# EAGLE schematic main_low_pass (EAGLE 6.4)
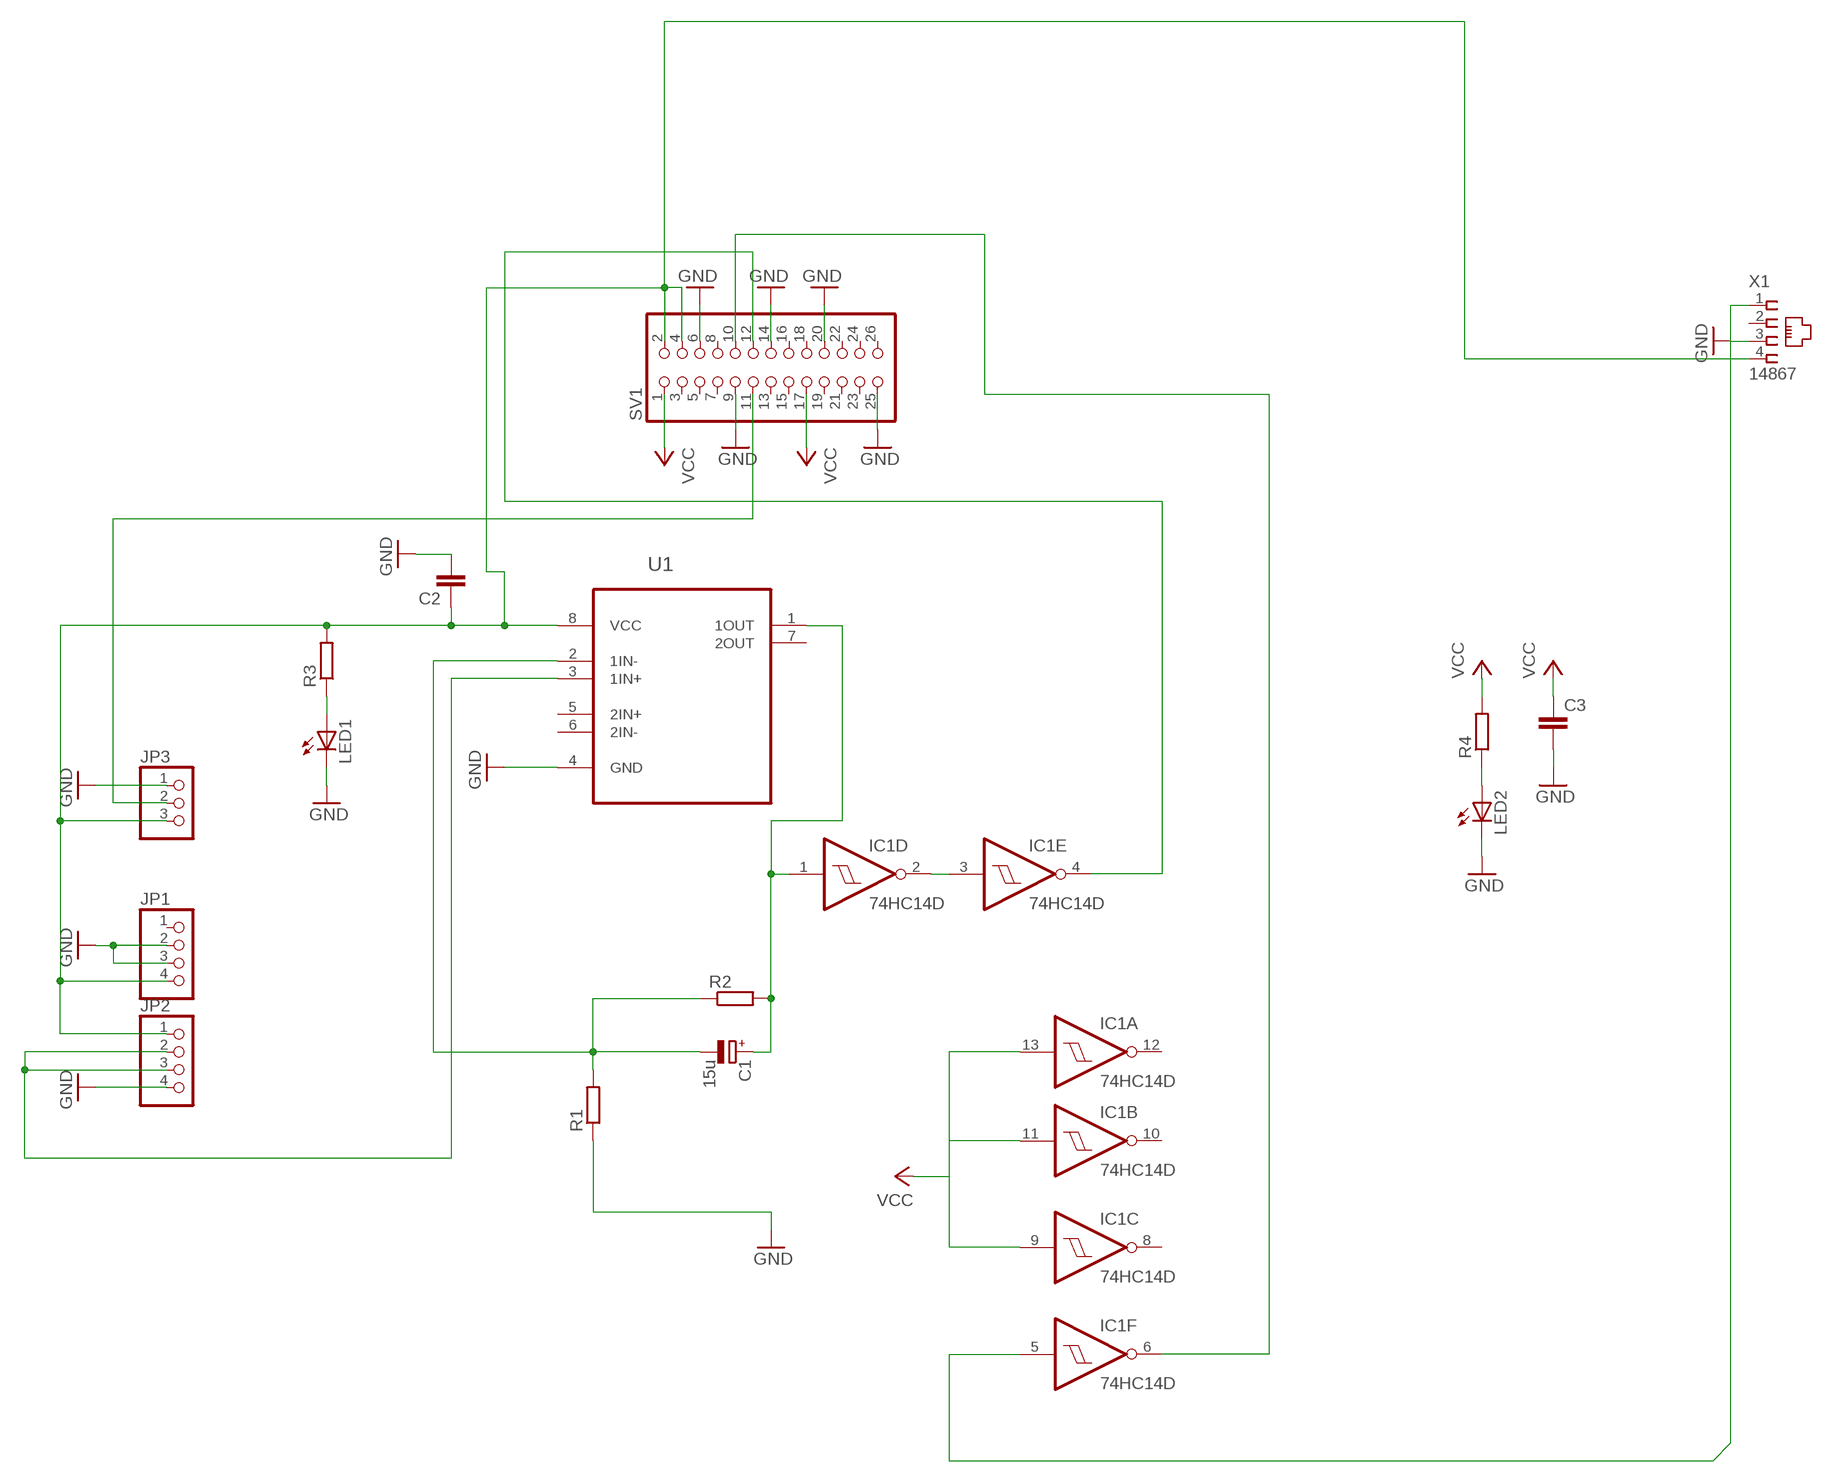
[diagram p0: schematic, sheet 1]

## Parts
C1  15u  CPOL-EU153CLV-0605  [153CLV-0605]
C2  C-EUC0805  [C0805]
C3  C-EUC0805  [C0805]
IC1  74HC14D  [SO14]
JP1  PINHD-1X4  [1X04]
JP2  PINHD-1X4  [1X04]
JP3  PINHD-1X3  [1X03]
LED1  LEDCHIP-LED0805  [CHIP-LED0805]
LED2  LEDCHIP-LED0805  [CHIP-LED0805]
R1  R-EU_R0805  [R0805]
R2  R-EU_R0805  [R0805]
R3  R-EU_R0805  [R0805]
R4  R-EU_R0805  [R0805]
SV1  PINHD-2X13  [2X13]
U1  LM358PW  [SOP65P640X120-8N]
X1  14867  [14867]

## Nets
GND: C2.2 C3.2 JP1.2 JP1.3 JP2.4 JP3.1 LED1.C LED2.C R1.1 SV1.6 SV1.9 SV1.14 SV1.20 SV1.25 U1.4(GND) X1.3
N$1: JP2.2 JP2.3 U1.3(1IN+)
N$2: C1.- R1.2 R2.1 U1.2(1IN-)
N$3: IC1.2(D:O) IC1.3(E:I)
N$4: IC1.5(F:I) X1.1
N$5: JP3.2 SV1.11
N$6: C2.1 JP1.4 JP2.1 JP3.3 R3.2 SV1.2 SV1.4 U1.8(VCC) X1.4
N$7: C1.+ IC1.1(D:I) R2.2 U1.1(1OUT)
N$8: LED1.A R3.1
N$9: LED2.A R4.1
N$10: IC1.4(E:O) SV1.12
N$11: IC1.6(F:O) SV1.10
VCC: C3.1 IC1.9(C:I) IC1.11(B:I) IC1.13(A:I) R4.2 SV1.1 SV1.17
Unconnected: IC1.8(C:O) IC1.10(B:O) IC1.12(A:O) JP1.1 SV1.3 SV1.5 SV1.7 SV1.8 SV1.13 SV1.15 SV1.16 SV1.18 SV1.19 SV1.21 SV1.22 SV1.23 SV1.24 SV1.26 U1.5(2IN+) U1.6(2IN-) U1.7(2OUT) X1.2

## Power pins joined to a net without a drawn wire
GND: IC1.7(P:GND)
VCC: IC1.14(P:VCC)

## Library data of the parts
C1 = resistor:CPOL-EU: POLARIZED CAPACITOR, European symbol
C2 C3 = resistor:C-EU: CAPACITOR, European symbol
IC1 = 74xx-eu:74*14: Hex schmitt trigger INVERTER
JP1 JP2 = pinhead:PINHD-1X4: PIN HEADER
JP3 = pinhead:PINHD-1X3: PIN HEADER
LED1 LED2 = led:LED: LED OSRAM: - CHIPLED LG R971, LG N971, LY N971, LG Q971, LY Q971, LO R971, LY R971 LH N974, LH R974 LS Q976, LO Q976, LY Q976 LO Q996 - Hyper CHIPLED LW Q18S LB Q993, LB Q99A, LB R99A - SideLED LS A670, LO A670, LY A670, LG A670, LP A670 LB A673, LV A673, LT A673, LW A673 LH A674 LY A675 LS A676, LA A676, LO A676, LY A676, LW A676 LS A679, LY A679, LG A679 - Hyper Micro SIDELED® LS Y876, LA Y876, LO Y876, LY Y876 LT Y87S - SmartLED LW L88C, LW L88S LB L89C, LB L89S, LG L890 LS L89K, LO L89K, LY L89K LS L896, LA L896, LO L896, LY L896 - TOPLED LS T670, LO T670, LY T670, LG T670, LP T670 LSG T670, LSP T670, LSY T670, LOP T670, LYG T670 LG T671, LOG T671, LSG T671 LB T673, LV T673, LT T673, LW T673 LH T674 LS T676, LA T676, LO T676, LY T676, LB T676, LH T676, LSB T676, LW T676 LB T67C, LV T67C, LT T67C, LS T67K, LO T67K, LY T67K, LW E67C LS E67B, LA E67B, LO E67B, LY E67B, LB E67C, LV E67C, LT E67C LW T67C LS T679, LY T679, LG T679 LS T770, LO T770, LY T770, LG T770, LP T770 LB T773, LV T773, LT T773, LW T773 LH T774 LS E675, LA E675, LY E675, LS T675 LS T776, LA T776, LO T776, LY T776, LB T776 LHGB T686 LT T68C, LB T68C - Hyper Mini TOPLED® LB M676 - Mini TOPLED Santana® LG M470 LS M47K, LO M47K, LY M47K Source: http://www.osram.convergy.de LUXEON: - LUMILED® LXK2-PW12-R00, LXK2-PW12-S00, LXK2-PW14-U00, LXK2-PW14-V00 LXK2-PM12-R00, LXK2-PM12-S00, LXK2-PM14-U00 LXK2-PE12-Q00, LXK2-PE12-R00, LXK2-PE12-S00, LXK2-PE14-T00, LXK2-PE14-U00 LXK2-PB12-K00, LXK2-PB12-L00, LXK2-PB12-M00, LXK2-PB14-N00, LXK2-PB14-P00, LXK2-PB14-Q00 LXK2-PR12-L00, LXK2-PR12-M00, LXK2-PR14-Q00, LXK2-PR14-R00 LXK2-PD12-Q00, LXK2-PD12-R00, LXK2-PD12-S00 LXK2-PH12-R00, LXK2-PH12-S00 LXK2-PL12-P00, LXK2-PL12-Q00, LXK2-PL12-R00 Source: www.luxeon.com KINGBRIGHT: KA-3528ASYC Source: www.kingbright.com
R1-R4 = resistor:R-EU_: RESISTOR, European symbol
SV1 = pinhead:PINHD-2X13: PIN HEADER
U1 = untitled:LM358PW: DUAL OPERATIONAL AMPLIFIERS; MPN: LM358PW; OC_FARNELL: 8389250; OC_NEWARK: 38K3721; PACKAGE: TSSOP-8; SUPPLIER: Texas Instruments
X1 = con-4ucon:14867: RJ11 Connector Source: 4UCON TECHNOLOGY INC. 14867.pdf; OC_FARNELL: unknown; OC_NEWARK: unknown